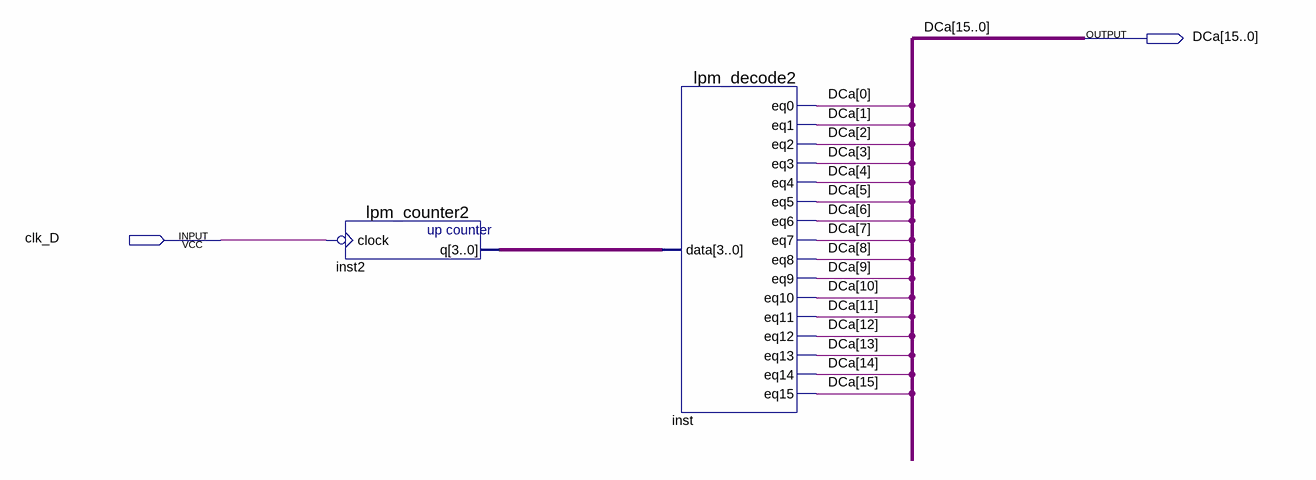
[diagram p0: schematic sheet]
// Quartus schematic scheme3.bdf as structural Verilog: 2 symbols, 2 pins
module scheme3 (
  input  clk_D,
  output [15:0] DCa
);

  wire [3:0] inst2_q;

  lpm_counter2 inst2 (.clock(~clk_D), .q(inst2_q));
  lpm_decode2 inst (
    .data(inst2_q), .eq0(DCa[0]), .eq1(DCa[1]), .eq2(DCa[2]), .eq3(DCa[3]), .eq4(DCa[4]), .eq5(DCa[5]),
    .eq6(DCa[6]), .eq7(DCa[7]), .eq8(DCa[8]), .eq9(DCa[9]), .eq10(DCa[10]), .eq11(DCa[11]), .eq12(DCa[12]),
    .eq13(DCa[13]), .eq14(DCa[14]), .eq15(DCa[15]));
endmodule
